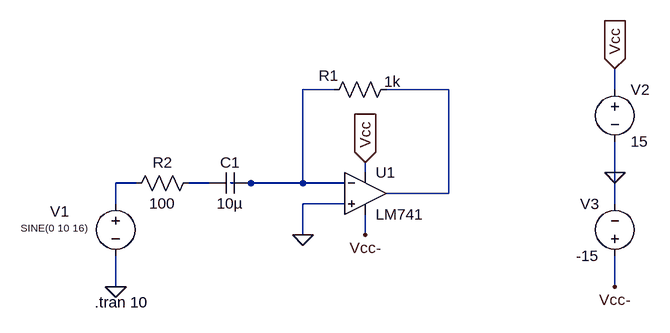
[diagram p0: schematic Draft3.asc]
Draft3.asc, the LTspice schematic file:
Version 4
SHEET 1 1176 680
WIRE 320 32 272 32
WIRE 496 32 400 32
WIRE 752 32 752 0
WIRE 368 160 368 144
WIRE 752 160 752 112
WIRE 16 176 -16 176
WIRE 128 176 96 176
WIRE 192 176 160 176
WIRE 272 176 272 32
WIRE 272 176 192 176
WIRE 336 176 272 176
WIRE 496 192 496 32
WIRE 496 192 400 192
WIRE -16 208 -16 176
WIRE 336 208 272 208
WIRE 752 208 752 160
WIRE 272 256 272 208
WIRE 368 256 368 224
WIRE -16 336 -16 288
WIRE 752 336 752 288
FLAG 272 256 0
FLAG -16 336 0
FLAG 368 144 Vcc
IOPIN 368 144 In
FLAG 368 256 Vcc-
FLAG 752 160 0
FLAG 752 0 Vcc
IOPIN 752 0 In
FLAG 752 336 Vcc-
SYMBOL res 416 16 R90
WINDOW 0 10 104 VBottom 2
WINDOW 3 -12 6 VTop 2
SYMATTR InstName R1
SYMATTR Value 1k
SYMBOL voltage -16 192 R0
WINDOW 3 -44 53 Right 1
WINDOW 123 0 0 Left 0
WINDOW 39 0 0 Left 0
WINDOW 0 -101 28 Left 2
SYMATTR Value SINE(0 10 16)
SYMATTR InstName V1
SYMBOL 741\\LM741 368 128 R0
SYMATTR InstName U1
SYMBOL cap 192 160 R90
WINDOW 0 0 32 VBottom 2
WINDOW 3 32 32 VTop 2
SYMATTR InstName C1
SYMATTR Value 10µ
SYMBOL voltage 752 16 R0
WINDOW 123 0 0 Left 0
WINDOW 39 0 0 Left 0
SYMATTR InstName V2
SYMATTR Value 15
SYMBOL voltage 752 304 R180
WINDOW 0 24 96 Left 2
WINDOW 3 24 16 Left 2
WINDOW 123 0 0 Left 0
WINDOW 39 0 0 Left 0
SYMATTR InstName V3
SYMATTR Value -15
SYMBOL res 112 160 R90
WINDOW 0 0 56 VBottom 2
WINDOW 3 32 56 VTop 2
SYMATTR InstName R2
SYMATTR Value 100
TEXT -48 360 Left 2 !.tran 10

The netlist it stands for:
* Draft3.asc
R1 N002 N001 1k
V1 N003 0 SINE(0 10 16)
XU1 0 N001 Vcc Vcc- N002 LM741  ; pins In+ In- V+ V- OUT
C1 N001 N004 10µ
V2 Vcc 0 15
V3 Vcc- 0 -15
R2 N004 N003 100
.tran 10
.lib LM741.lib
.backanno
.end